# Altium schematic sheet main.SchDoc
size A4
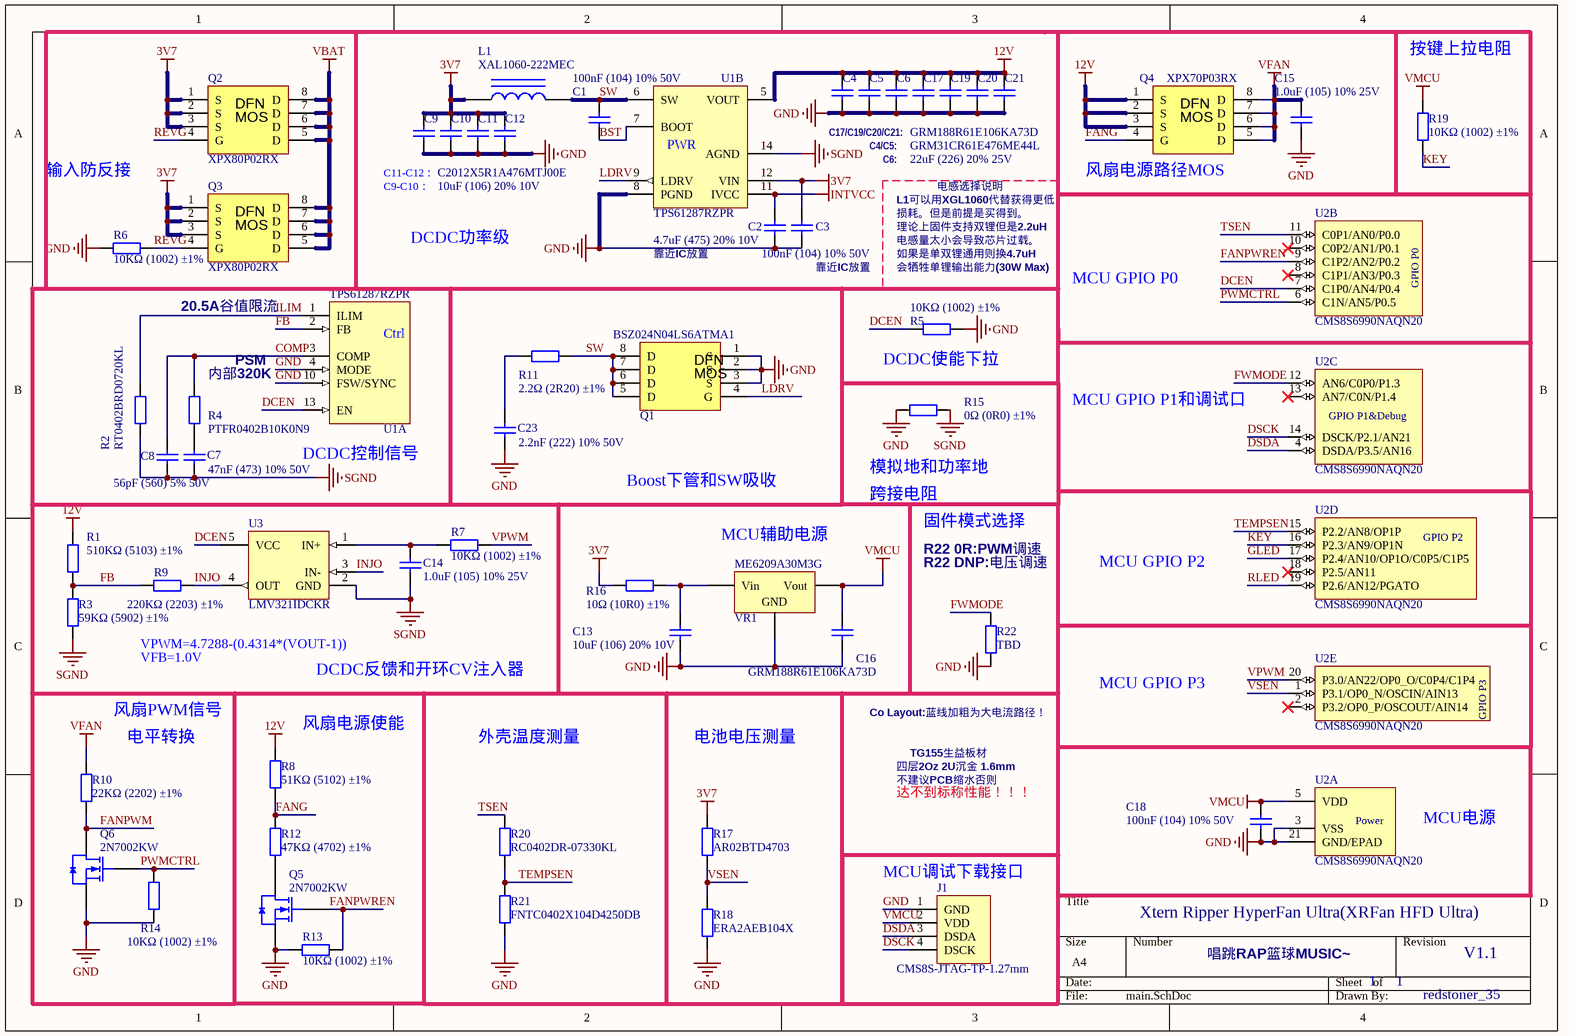
[diagram p0: main.SchDoc]

## Parts
C1  100nF (104) 10% 50V  [0402_C]
C2  4.7uF (475) 20% 10V  [0402_C]
C3  100nF (104) 10% 50V  [0402_C]
C4  GRM31CR61E476ME44L  [1206C]
C5  GRM31CR61E476ME44L  [1206C]  (value not drawn)
C6  22uF (226) 20% 25V  [0805_C]
C7  47nF (473) 10% 50V  [0402_C]
C8  56pF (560) 5% 50V  [0402_C]
C9  10uF (106) 20% 10V  [0402_C]
C10  10uF (106) 20% 10V  [0402_C]  (value not drawn)
C11  C2012X5R1A476MTJ00E  [0805_C]
C12  C2012X5R1A476MTJ00E  [0805_C]  (value not drawn)
C13  10uF (106) 20% 10V  [0402_C]
C14  1.0uF (105) 10% 25V  [0402_C]
C15  1.0uF (105) 10% 25V  [0402_C]
C16  GRM188R61E106KA73D  [0603_C]
C17  GRM188R61E106KA73D  [0603_C]
C18  100nF (104) 10% 50V  [0402_C]
C19  GRM188R61E106KA73D  [0603_C]  (value not drawn)
C20  GRM188R61E106KA73D  [0603_C]  (value not drawn)
C21  GRM188R61E106KA73D  [0603_C]  (value not drawn)
C23  2.2nF (222) 10% 50V  [0402_C]
J1  CMS8S-JTAG-TP-1.27mm  [CMS8S-JTAG-TP-2x2-P1.27]
L1  XAL1060-222MEC  [XAL1060-472ME-Lifted]
Q1  BSZ024N04LS6ATMA1  [DFN-8_L3.0-W3.0-P0.65-BL]
Q2  XPX80P02RX  [DFN-8_L3.0-W3.0-P0.65-BL]
Q3  XPX80P02RX  [DFN-8_L3.0-W3.0-P0.65-BL]
Q4  XPX70P03RX  [DFN-8_L3.0-W3.0-P0.65-BL]
Q5  2N7002KW  [SC70-3]
Q6  2N7002KW  [SC70-3]
R1  510KΩ (5103) ±1%  [0402_R]
R2  RT0402BRD0720KL  [0402_R]
R3  59KΩ (5902) ±1%  [0402_R]
R4  PTFR0402B10K0N9  [0402_R]
R5  10KΩ (1002) ±1%  [0402_R]
R6  10KΩ (1002) ±1%  [0402_R]
R7  10KΩ (1002) ±1%  [0402_R]
R8  51KΩ (5102) ±1%  [0402_R]
R9  220KΩ (2203) ±1%  [0402_R]
R10  22KΩ (2202) ±1%  [0402_R]
R11  2.2Ω (2R20) ±1%  [0603_R]
R12  47KΩ (4702) ±1%  [0402_R]
R13  10KΩ (1002) ±1%  [0402_R]
R14  10KΩ (1002) ±1%  [0402_R]
R15  0Ω (0R0) ±1%  [0402_R]
R16  10Ω (10R0) ±1%  [0402_R]
R17  AR02BTD4703  [0402_R]
R18  ERA2AEB104X  [0402_R]
R19  10KΩ (1002) ±1%  [0402_R]
R20  RC0402DR-07330KL  [0402_R]
R21  FNTC0402X104D4250DB  [0402_R]
R22  TBD  [0402_R]
U1  TPS61287RZPR  [RZP0014A-TPS61287]  (parts A,B of 2)
U2  CMS8S6990NAQN20  [QFN40P300X300X800_HS-21N]  (parts A,B,C,D,E of 5)
U3  LMV321IDCKR  [SC70-5]
VR1  ME6209A30M3G  [SOT-23-3L]

## Nets
3V7: C3.2 C9.2 C10.2 C11.2 C12.2 L1.1 Q2.1(S) Q2.2(S) Q2.3(S) Q3.1(S) Q3.2(S) Q3.3(S) R16.1 R17.2 U1.12(VIN)
12V: C4.2 C5.2 C6.2 C17.2 C19.2 C20.2 C21.2 Q4.1(S) Q4.2(S) Q4.3(S) R1.2 R8.2 U1.5(VOUT)
GND: C2.1 C3.1 C4.1 C5.1 C6.1 C9.1 C10.1 C11.1 C12.1 C13.1 C15.1 C16.1 C17.1 C18.1 C19.1 C20.1 C21.1 C23.1 J1.1(GND) Q1.1(S) Q1.2(S) Q1.3(S) Q5.2(S) Q6.2(S) R5.1 R6.1 R13.2 R14.1 R15.1 R18.1 R21.1 R22.2 U1.4(MODE) U1.8(PGND) U1.10(FSW/SYNC) U2.3(VSS) U2.21(GND/EPAD) VR1.1(GND)
INTVCC: C2.2 U1.11(IVCC)
SGND: C7.1 C8.1 C14.1 R2.2 R3.1 R15.2 U1.14(AGND) U3.2(GND)
VBAT: Q2.5(D) Q2.6(D) Q2.7(D) Q2.8(D) Q3.5(D) Q3.6(D) Q3.7(D) Q3.8(D)
VFAN: C15.2 Q4.5(D) Q4.6(D) Q4.7(D) Q4.8(D) R10.2
VMCU: C16.2 C18.2 J1.2(VDD) R19.2 U2.5(VDD) VR1.2(Vout)
BST: C1.1 U1.7(BOOT)
COMP: C8.2 R4.2 U1.3(COMP)
DCEN: R5.2 U1.13(EN) U2.7(C1P0/AN4/P0.4) U3.5(VCC)
DSCK: J1.4(DSCK) U2.14(DSCK/P2.1/AN21)
DSDA: J1.3(DSDA) U2.4(DSDA/P3.5/AN16)
FANG: Q4.4(G) R8.1 R12.2
FANPWM: Q6.3(D) R10.1
FANPWREN: Q5.1(G) R13.1 U2.9(C1P2/AN2/P0.2)
FB: R1.1 R3.2 R9.1 U1.2(FB)
FWMODE: R22.1 U2.12(AN6/C0P0/P1.3)
GLED: U2.17(P2.4/AN10/OP1O/C0P5/C1P5)
ILIM: R2.1 U1.1(ILIM)
INJO: R9.2 U3.3(IN-) U3.4(OUT)
KEY: R19.1 U2.16(P2.3/AN9/OP1N)
LDRV: Q1.4(G) U1.9(LDRV)
PWMCTRL: Q6.1(G) R14.2 U2.6(C1N/AN5/P0.5)
REVG: Q2.4(G) Q3.4(G) R6.2
RLED: U2.19(P2.6/AN12/PGATO)
SW: C1.2 L1.2 Q1.5(D) Q1.6(D) Q1.7(D) Q1.8(D) R11.2 U1.6(SW)
TEMPSEN: R20.1 R21.2 U2.15(P2.2/AN8/OP1P)
TSEN: R20.2 U2.11(C0P1/AN0/P0.0)
VPWM: R7.2 U2.20(P3.0/AN22/OP0_O/C0P4/C1P4)
VSEN: R17.1 R18.2 U2.1(P3.1/OP0_N/OSCIN/AIN13)
NetC7_2: C7.2 R4.1
NetC13_2: C13.2 R16.2 VR1.3(Vin)
NetC14_2: C14.2 R7.1 U3.1(IN+)
NetC23_2: C23.2 R11.1
NetQ5_3: Q5.3(D) R12.1

Not connected (* = marked no-connect by the designer): U2 2(P3.2/OP0_P/OSCOUT/AIN14)* 8(C1P1/AN3/P0.3)* 10(C0P2/AN1/P0.1)* 13(AN7/C0N/P1.4)* 18(P2.5/AN11)*

## Notes on the sheet
- 按键上拉电阻
- 输入防反接
- C11-C12：
- C17/C19/C20/C21:
- C4/C5:
- C6:
- (near Q4) 风扇电源路径MOS
- C9-C10：
- DCDC功率级
- L1可以用XGL1060代替获得更低
- 损耗。但是前提是买得到。
- 理论上固件支持双锂但是2.2uH
- 电感量太小会导致芯片过载。
- 电感选择说明
- 20.5A谷值限流
- 靠近IC放置
- 如果是单双锂通用则换4.7uH
- 会牺牲单锂输出能力(30W Max)
- MCU GPIO P0
- (near R4) 内部320K
- PSM
- (near R5) DCDC使能下拉
- MCU GPIO P1和调试口
- (near U1) DCDC控制信号
- Boost下管和SW吸收
- (near R15) 模拟地和功率地
- 跨接电阻
- (near VR1) MCU辅助电源
- 固件模式选择
- R22 0R:PWM调速
- R22 DNP:电压调速
- MCU GPIO P2
- VPWM=4.7288-(0.4314*(VOUT-1))
- 风扇PWM信号
- VFB=1.0V
- DCDC反馈和开环CV注入器
- Co Layout:蓝线加粗为大电流路径！
- MCU GPIO P3
- (near R10) 电平转换
- (near R8) 风扇电源使能
- 外壳温度测量
- 电池电压测量
- 四层2Oz 2U沉金 1.6mm
- 不建议PCB缩水否则
- TG155生益板材
- 达不到标称性能！！！
- MCU电源
- (near J1) MCU调试下载接口
- Xtern Ripper HyperFan Ultra(XRFan HFD Ultra)
- 唱跳RAP篮球MUSIC~
- 1
- V1.1
- redstoner_35
- (in symbol CM8S6990NA-QFN20, part A) Power
- (in symbol CM8S6990NA-QFN20, part B) GPIO P0
- (in symbol CM8S6990NA-QFN20, part C) GPIO P1&Debug
- (in symbol CM8S6990NA-QFN20, part D) GPIO P2
- (in symbol CM8S6990NA-QFN20, part E) GPIO P3
- (in symbol SON/DFN5x6 MOS) DFN; MOS
- (in symbol TPS61287, part A) Ctrl
- (in symbol TPS61287, part B) PWR

## Library data of the parts
C1 C3 C7 C18 = 0402 100nF (104) 10% 16V: 贴片电容; ComponentLink1Description: 供应商链接; ComponentLink1URL: http://www.szlcsc.com/product/details_1877.html; Package: 0402; Supplier: LC; SuppliersPartNumber: C1525
C2 = 0402 4.7uF (475) 20% 10V: 贴片电容; ComponentLink1Description: 供应商链接; ComponentLink1URL: http://www.szlcsc.com/product/details_24469.html; Package: 0402; Supplier: LC; SuppliersPartNumber: C23733
C4 C5 = Cap: 1206尺寸村田MLCC 25V 47uF X5R ±20%; Published: 8-Jun-2000; LatestRevisionDate: 17-Jul-2002; LatestRevisionNote: Re-released for DXP Platform.; PackageReference: RAD-0.3; Publisher: Altium Limited; PackageDescription: Radial Cap, Thru-Hole; 2 Leads; 0.3 in Pin Spacing; Value: 47uF
C6 = 0805 22uF (226) 20% 25V: 贴片电容; ComponentLink1Description: 供应商链接; ComponentLink1URL: http://www.szlcsc.com/product/details_46786.html; Package: 0805; Supplier: LC; SuppliersPartNumber: C45783
C8 = 0402 56pF (560) 5% 50V: 贴片电容; ComponentLink1Description: 供应商链接; ComponentLink1URL: http://www.szlcsc.com/product/details_1924.html; Package: 0402; Supplier: LC; SuppliersPartNumber: C1572
C9 C10 C13 = 0402 10uF (106) 20% 6.3V: 贴片电容; ComponentLink1Description: 供应商链接; ComponentLink1URL: http://www.szlcsc.com/product/details_16204.html; Package: 0402; Supplier: LC; SuppliersPartNumber: C15525
C11 C12 = 0805 22uF (226) 20% 25V: 贴片MLCC电容，X5R 47uF ±20% 10V; ComponentLink1Description: 供应商链接; ComponentLink1URL: http://www.szlcsc.com/product/details_46786.html; Package: 0805; Supplier: LC; SuppliersPartNumber: C45783
C14 C15 = 0402 1.0uF (105) 10% 25V: 贴片电容; ComponentLink1Description: 供应商链接; ComponentLink1URL: http://www.szlcsc.com/product/details_53938.html; Package: 0402; Supplier: LC; SuppliersPartNumber: C52923
C16 C17 C19-C21 = 0603 10uF (106) 10% 10V: 村田贴片MLCC电容 25V 10uF±20% X5R 0603封装; ComponentLink1Description: 供应商链接; ComponentLink1URL: http://www.szlcsc.com/product/details_20411.html; Package: 0603; Supplier: LC; SuppliersPartNumber: C19702
C23 = 0402 2.2nF (222) 10% 50V: 贴片电容; ComponentLink1Description: 供应商链接; ComponentLink1URL: http://www.szlcsc.com/product/details_1883.html; Package: 0402; Supplier: LC; SuppliersPartNumber: C1531
J1 = CMS8S-JTAG-TP-1.27mm: 面向CMS8S6990NA单片机的调试贴片触点，并不是元器件实物
L1 = Inductor Iron: 线艺一体成型模压电感，9.8mΩ DCR 25A饱和电流 4.7uH±20%电感量 10*11*6mm尺寸; Value: 4.7uH; Published: 24-Mar-1999; LatestRevisionDate: 17-Jul-2002; LatestRevisionNote: Re-released for DXP Platform.; PackageReference: AXIAL-0.9; Publisher: Altium Limited; PackageDescription: Axial Device, Thru-Hole; 2 Leads; 0.9 in Pin Spacing
Q1 = SON/DFN5x6 MOS: 英飞凌OptiMOS 6 40V N沟道功率MOS 2.8mΩ@4.5V S3O8封装
Q2 Q3 = SON/DFN5x6 MOS: PDFN3x3 30V 50A N沟道MOSFET
Q4 = SON/DFN5x6 MOS: -30V -70A 6.5mR P沟道增强型MOSFET
Q5 Q6 = 2N7002 7002: 单N沟道MOSFET(场效应管); ComponentLink1Description: 供应商链接; ComponentLink1URL: http://www.szlcsc.com/product/details_9040.html; Package: SOT-323; Supplier: LC; SuppliersPartNumber: C???????
R1 R3 = 0402 510KΩ (5103) 1%: 贴片电阻; ComponentLink1Description: 供应商链接; ComponentLink1URL: http://www.szlcsc.com/product/details_12170.html; Package: 0402; Supplier: LC; SuppliersPartNumber: C11616
R2 = 0402 20KΩ (2002) 1%: 0402贴片薄膜高精密电阻 20KΩ ±0.1% 62.5mW 25PPM; ComponentLink1Description: 供应商链接; ComponentLink1URL: http://www.szlcsc.com/product/details_26508.html; Package: 0402; Supplier: LC; SuppliersPartNumber: C25765
R4 = 0402 12KΩ (1202) 1%: 0402贴片薄膜高精密电阻 10KΩ ±0.1% 62.5mW 25PPM; ComponentLink1Description: 供应商链接; ComponentLink1URL: http://www.szlcsc.com/product/details_26495.html; Package: 0402; Supplier: LC; SuppliersPartNumber: C25752
R5-R7 R13 R14 R19 = 0402 10KΩ (1002) 1%: 贴片电阻; ComponentLink1Description: 供应商链接; ComponentLink1URL: http://www.szlcsc.com/product/details_26487.html; Package: 0402; Supplier: LC; SuppliersPartNumber: C25744
R8 = 0402 47KΩ (4702) 1%: 贴片电阻; ComponentLink1Description: 供应商链接; ComponentLink1URL: http://www.szlcsc.com/product/details_26535.html; Package: 0402; Supplier: LC; SuppliersPartNumber: C25792
R9 = 0402 100KΩ (1003) 1%: 贴片电阻; ComponentLink1Description: 供应商链接; ComponentLink1URL: http://www.szlcsc.com/product/details_26484.html; Package: 0402; Supplier: LC; SuppliersPartNumber: C25741
R10 = 0402 22KΩ (2202) 1%: 贴片电阻; ComponentLink1Description: 供应商链接; ComponentLink1URL: http://www.szlcsc.com/product/details_26511.html; Package: 0402; Supplier: LC; SuppliersPartNumber: C25768
R11 = 0603 2.2Ω (2R20) 1%: 贴片电阻; ComponentLink1Description: 供应商链接; ComponentLink1URL: http://www.szlcsc.com/product/details_23666.html; Package: 0603; Supplier: LC; SuppliersPartNumber: C22939
R12 = 0402 51KΩ (5102) 1%: 贴片电阻; ComponentLink1Description: 供应商链接; ComponentLink1URL: http://www.szlcsc.com/product/details_26537.html; Package: 0402; Supplier: LC; SuppliersPartNumber: C25794
R15 R22 = 0402 0Ω (0R0) 1%: 贴片电阻; ComponentLink1Description: 供应商链接; ComponentLink1URL: http://www.szlcsc.com/product/details_17853.html; Package: 0402; Supplier: LC; SuppliersPartNumber: C17168
R16 = 0402 10Ω (10R0) 1%: 贴片电阻; ComponentLink1Description: 供应商链接; ComponentLink1URL: http://www.szlcsc.com/product/details_25820.html; Package: 0402; Supplier: LC; SuppliersPartNumber: C25077
R17 = 0402 470KΩ (4703) 1%: 0402 贴片薄膜高精密低温飘电阻 470KΩ±0.1% 25PPM; ComponentLink1Description: 供应商链接; ComponentLink1URL: http://www.szlcsc.com/product/details_26533.html; Package: 0402; Supplier: LC; SuppliersPartNumber: C25790
R18 = 0402 100KΩ (1003) 1%: 松下 0402精密低温飘贴片电阻 100KΩ±0.1% 62.5mW; ComponentLink1Description: 供应商链接; ComponentLink1URL: http://www.szlcsc.com/product/details_26484.html; Package: 0402; Supplier: LC; SuppliersPartNumber: C25741
R20 = 0402 470KΩ (4703) 1%: 0402厚膜较高精度贴片电阻 330KΩ±0.5% 62.5mW; ComponentLink1Description: 供应商链接; ComponentLink1URL: http://www.szlcsc.com/product/details_26533.html; Package: 0402; Supplier: LC; SuppliersPartNumber: C25790
R21 = 0402 200KΩ (2003) 1%: 0402尺寸贴片式NTC热敏电阻 B25-85℃=4310±0.5% R25=100KΩ±0.5%; ComponentLink1Description: 供应商链接; ComponentLink1URL: http://www.szlcsc.com/product/details_26507.html; Package: 0402; Supplier: LC; SuppliersPartNumber: C25764
U1 = TPS61287: Synchronous Boost Converter with Stackable Multi-Phase Function
U2 = CM8S6990NA-QFN20: 增强型闪存1T 8051单片机，16KB Flash 256+1K XRAM
U3 = LMV321IDCKR: CMOS超小型运算放大器，SC70-5
VR1 = SOT-23 XC6206P332MR: 低压差线性稳压(LDO); ComponentLink1Description: 供应商链接; ComponentLink1URL: http://www.szlcsc.com/product/details_5896.html; Package: SOT-23; Supplier: LC; SuppliersPartNumber: C5446